# EAGLE design SAMD51_Breakout (EAGLE 9.0.1)
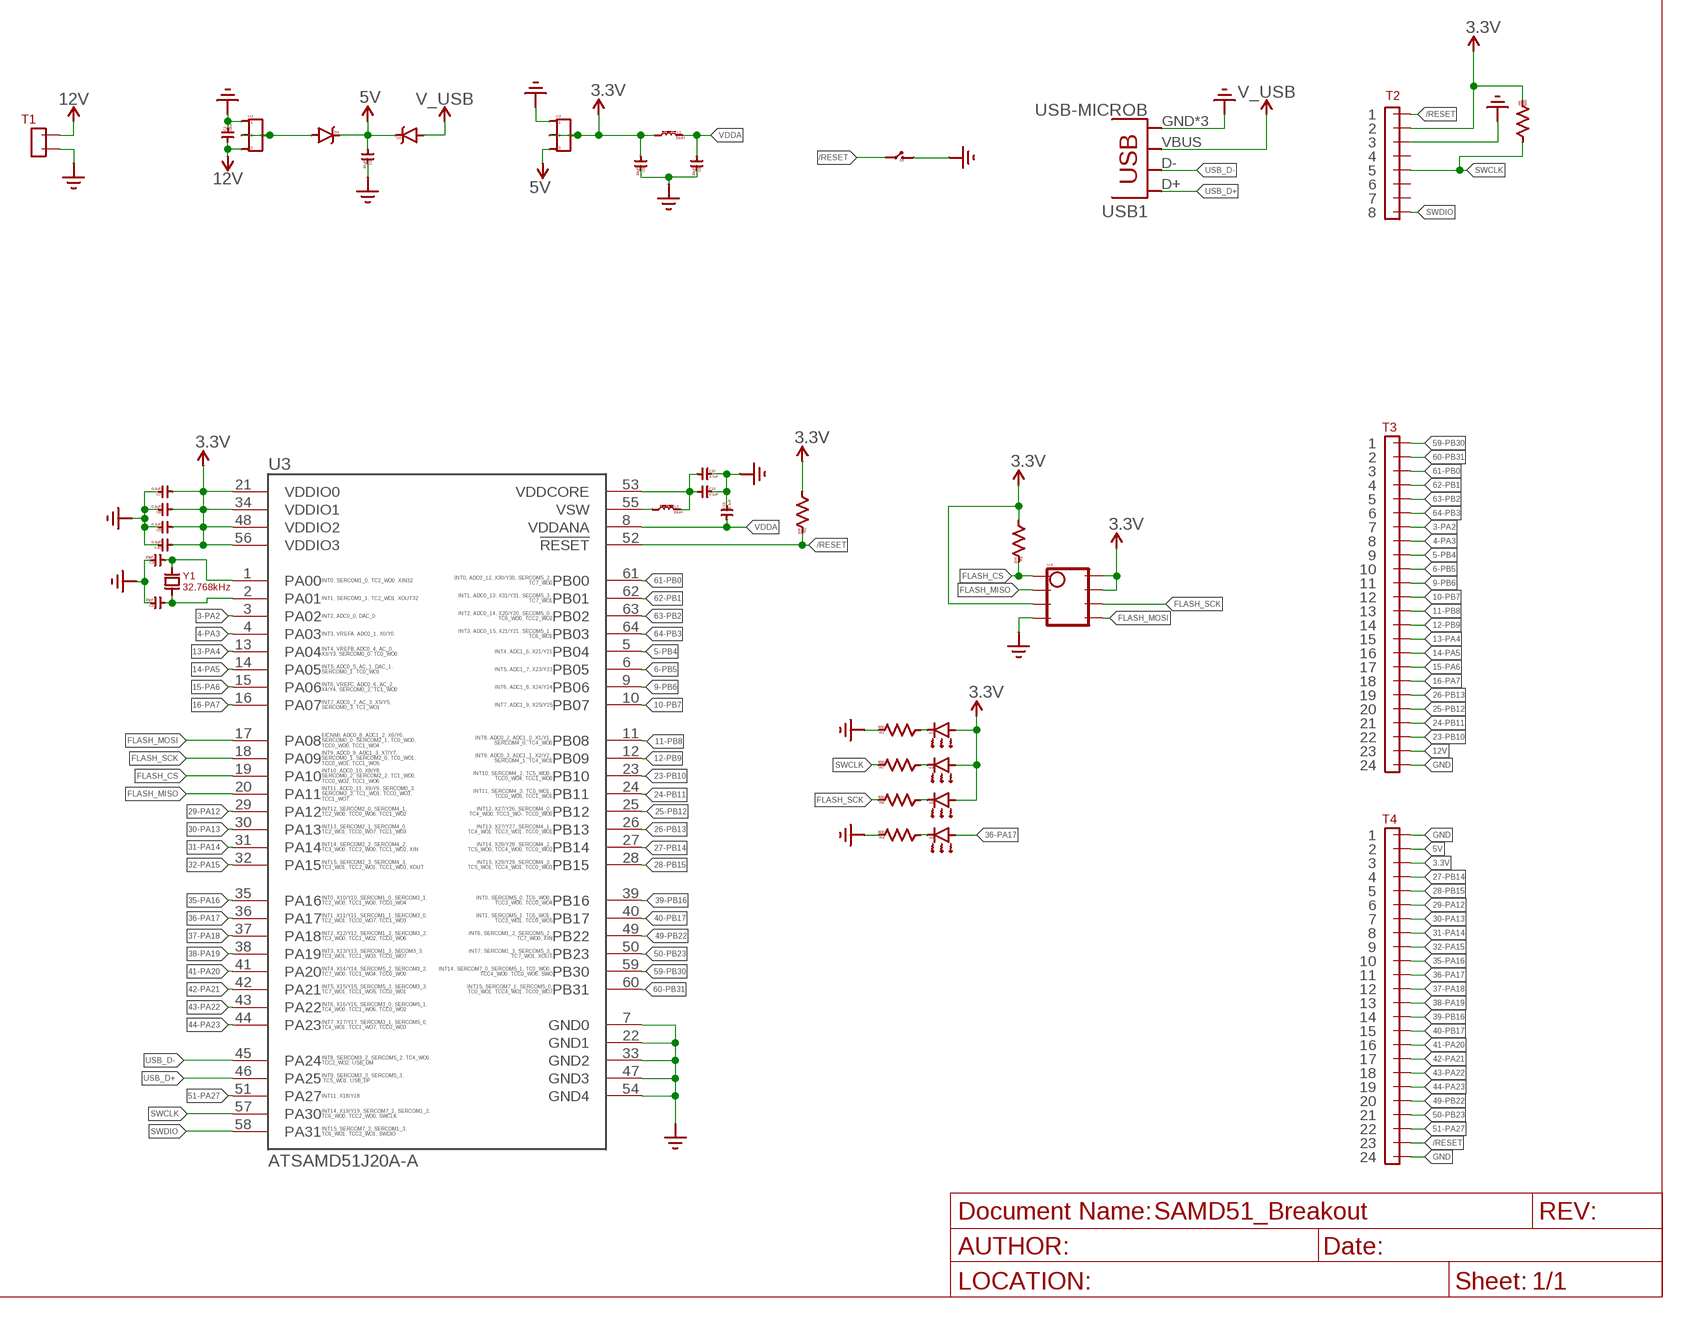
[diagram p0: schematic, sheet 1]

## Parts
C1  22uF  CAP0805  [0805]
C2  47uF  CAP0805  [0805]
C3  15pF  CAP0402  [0402]
C4  15pF  CAP0402  [0402]
C5  10uF  CAP0805  [0805]
C6  10uF  CAP0805  [0805]
C7  0.1uF  CAP0603  [0603]
C8  0.1uF  CAP0603  [0603]
C9  0.1uF  CAP0603  [0603]
C10  0.1uF  CAP0603  [0603]
C11  0.1uF  CAP0603  [0603]
C12  4.7uF  CAP0603  [0603]
C13  0.1uF  CAP0603  [0603]
D1  DIODE_SCHOTTKY1N5819  [1N5819_SMD]
D2  DIODE_SCHOTTKY1N5819  [1N5819_SMD]
L1  10uH  INDUCTOR0805  [0805]
L2  10uH  INDUCTOR0805  [0805]
R1  800  RESISTOR0805  [0805]
R2  10K  RESISTOR0805  [0805]
R3  10K  RESISTOR0805  [0805]
R4  800  RESISTOR0805  [0805]
R5  800  RESISTOR0805  [0805]
R6  800  RESISTOR0805  [0805]
R7  800  RESISTOR0805  [0805]
S1  SWITCHPTS647  [PTS647SK38SMTR2LFS]
T1  PHEONIX_1844210  [PHEONIX_1844210]
T2  CONN_08  [1X08_90DEG]
T3  CONN_24  [1X24]
T4  CONN_24  [1X24]
U1  STANDARD_SOT223  [SOT223]
U2  STANDARD_SOT223  [SOT223]
U3  ATSAMD51J20A-A  [TQFP64]
U4  STANDARD_SOIC-8  [SOIC8]
USB1  USB-MICROB  [USB-MICROB]
V1  LED_SMD0603  [LED_0603]
V2  LED_SMD0603  [LED_0603]
V3  LED_SMD0603  [LED_0603]
V4  LED_SMD0603  [LED_0603]
Y1  32.768kHz  CRYSTAL  [CM7V-T1A]

## Nets
3-PA2: T3.7 U3.3(PA02)
3.3V: C5.1 C7.1 C8.1 C9.1 C10.1 L1.1 R2.1 R3.1 R5.2 T2.2 T4.3 U2.2 U2.4 U3.21(VDDIO0) U3.34(VDDIO1) U3.48(VDDIO2) U3.56(VDDIO3) U4.3 U4.7 U4.8 V1.1 V3.1 V4.1
4-PA3: T3.8 U3.4(PA03)
5-PB4: T3.9 U3.5(PB04)
5V: C2.1 D1.P$2 D2.P$2 T4.2 U2.3
6-PB5: T3.10 U3.6(PB05)
9-PB6: T3.11 U3.9(PB06)
10-PB7: T3.12 U3.10(PB07)
11-PB8: T3.13 U3.11(PB08)
12-PB9: T3.14 U3.12(PB09)
12V: C1.1 T1.1 T3.23 U1.3
13-PA4: T3.15 U3.13(PA04)
14-PA5: T3.16 U3.14(PA05)
15-PA6: T3.17 U3.15(PA06)
16-PA7: T3.18 U3.16(PA07)
23-PB10: T3.22 U3.23(PB10)
24-PB11: T3.21 U3.24(PB11)
25-PB12: T3.20 U3.25(PB12)
26-PB13: T3.19 U3.26(PB13)
27-PB14: T4.4 U3.27(PB14)
28-PB15: T4.5 U3.28(PB15)
29-PA12: T4.6 U3.29(PA12)
30-PA13: T4.7 U3.30(PA13)
31-PA14: T4.8 U3.31(PA14)
32-PA15: T4.9 U3.32(PA15)
35-PA16: T4.10 U3.35(PA16)
36-PA17: T4.11 U3.36(PA17) V2.1
37-PA18: T4.12 U3.37(PA18)
38-PA19: T4.13 U3.38(PA19)
39-PB16: T4.14 U3.39(PB16)
40-PB17: T4.15 U3.40(PB17)
41-PA20: T4.16 U3.41(PA20)
42-PA21: T4.17 U3.42(PA21)
43-PA22: T4.18 U3.43(PA22)
44-PA23: T4.19 U3.44(PA23)
49-PB22: T4.20 U3.49(PB22)
50-PB23: T4.21 U3.50(PB23)
51-PA27: T4.22 U3.51(PA27)
59-PB30: T3.1 U3.59(PB30)
60-PB31: T3.2 U3.60(PB31)
61-PB0: T3.3 U3.61(PB00)
62-PB1: T3.4 U3.62(PB01)
63-PB2: T3.5 U3.63(PB02)
64-PB3: T3.6 U3.64(PB03)
/RESET: R2.2 S1.P$1 S1.P$2 T2.1 T4.23 U3.52(!RESET)
FLASH_CS: R3.2 U3.19(PA10) U4.1
FLASH_MISO: U3.20(PA11) U4.2
FLASH_MOSI: U3.17(PA08) U4.5
FLASH_SCK: R6.2 U3.18(PA09) U4.6
GND: C1.2 C2.2 C3.2 C4.2 C5.2 C6.2 C7.2 C8.2 C9.2 C10.2 C11.2 C12.2 C13.2 R1.2 R4.2 S1.P$3 S1.P$4 T1.2 T2.3 T3.24 T4.1 T4.24 U1.1 U2.1 U3.7(GND0) U3.22(GND1) U3.33(GND2) U3.47(GND3) U3.54(GND4) U4.4 USB1.GND USB1.MT1(GND) USB1.MT2(GND)
N$1: R1.1 V1.2
N$2: R4.1 V2.2
N$3: C4.1 U3.1(PA00) Y1.P$2
N$4: D1.P$1 U1.2 U1.4
N$5: C3.1 U3.2(PA01) Y1.P$1
N$6: R6.1 V3.2
N$7: R7.1 V4.2
SWCLK: R5.1 R7.2 T2.5 U3.57(PA30)
SWDIO: T2.8 U3.58(PA31)
USB_D+: U3.46(PA25) USB1.D+
USB_D-: U3.45(PA24) USB1.D-
V_USB: D2.P$1 USB1.VBUS
VDDA: C6.1 C11.1 L1.2 U3.8(VDDANA)
VDDCORE: C12.1 C13.1 L2.2 U3.53(VDDCORE)
VSW: L2.1 U3.55(VSW)
Unconnected: T2.4 T2.6 T2.7

## Library data of the parts
C1-C13 = Ernest_Components:CAP: General Capacitor
D1 D2 = Ernest_Components:DIODE_SCHOTTKY
L1 L2 = Ernest_Components:INDUCTOR
R1-R7 = Ernest_Components:RESISTOR: General Resistor
S1 = Ernest_Components:SWITCH
T1 = Ernest_Connectors:PHEONIX_1844210: 3- Pin 3.5mm pitch, 90 deg plug-in. Pheonix-1844210 connector. Datasheet: https://media.digikey.com/pdf/Data%20Sheets/Phoenix%20Contact%20PDFs/1844252.pdf <https://media.digikey.com/pdf/Data%20Sheets/Phoenix%20Contact%20PDFs/1844210.pdf>
T2 = Ernest_Connectors:CONN_08: Multi connection point. Often used as Generic Header-pin footprint for 0.1 inch spaced/style header connections
T3 T4 = Ernest_Connectors:CONN_24: Multi connection point. Often used as Generic Header-pin footprint for 0.1 inch spaced/style header connections
U1 U2 = Ernest_IC:STANDARD_SOT223: Voltage Regulator LM1117 Standard adjustable voltage regulator but in SMD form. Spark Fun Electronics SKU : COM-00595
U3 = SparkFun-IC-Microcontroller:ATSAMD51J20A-A; PROD_ID: IC-13952
U4 = Ernest_IC:STANDARD_SOIC-8
USB1 = Ernest_Connectors:USB: USB Connectors USB-B-PTH is fully proven SKU : PRT-00139/CONN-08278 USB-miniB is fully proven SKU : PRT-00587 USB-A-PCB is untested. USB-A-H is throughly reviewed, but untested. Spark Fun Electronics SKU : PRT-00437 USB-B-SMT is throughly reviewed, but untested. Needs silkscreen touching up. USB-A-S has not been used/tested USB-MB-H has not been used/tested USB-MICROB has been used. CONN-09505; PROD_ID: CONN-09505
V1-V4 = Ernest_Components:LED_SMD
Y1 = Ernest_Components:CRYSTAL: Murata Electronics SMD Resonator: CSTNE16M0V530000R0

## Board
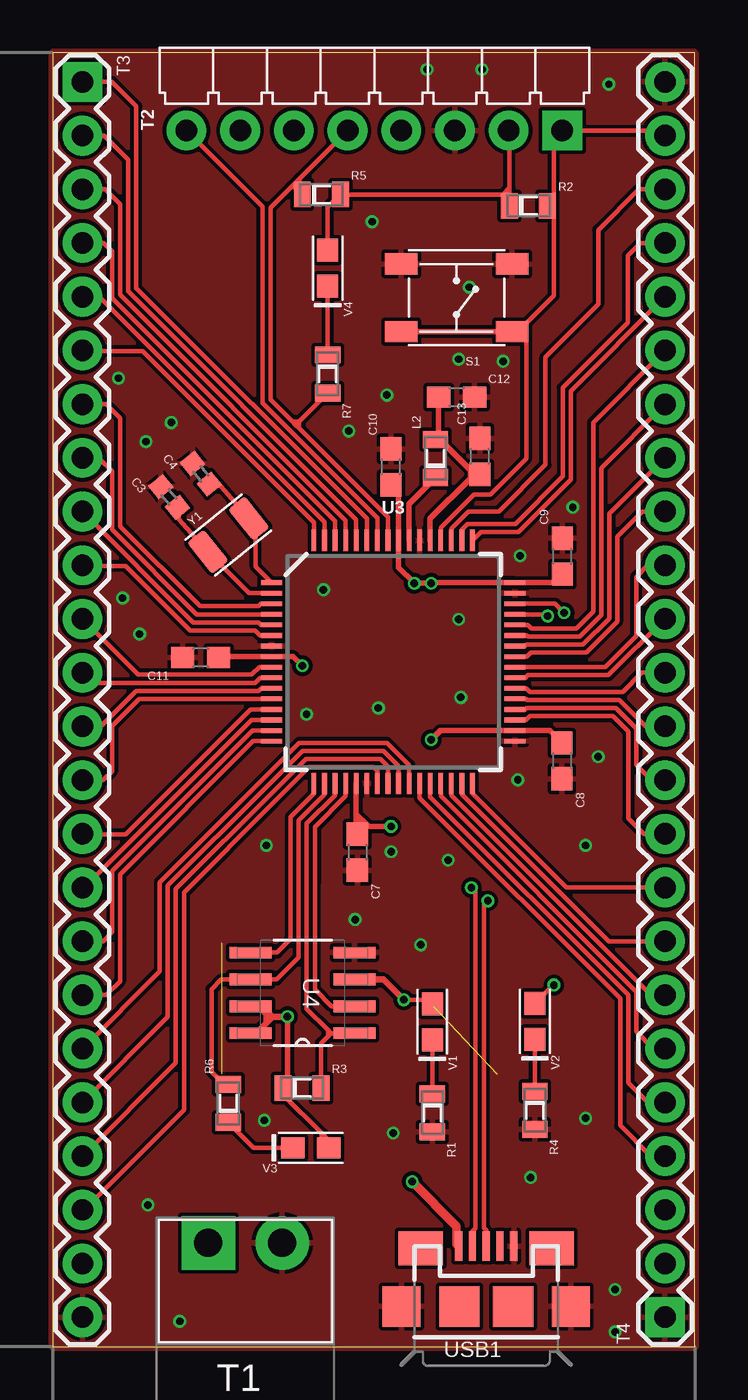
[diagram p1: board, top side]
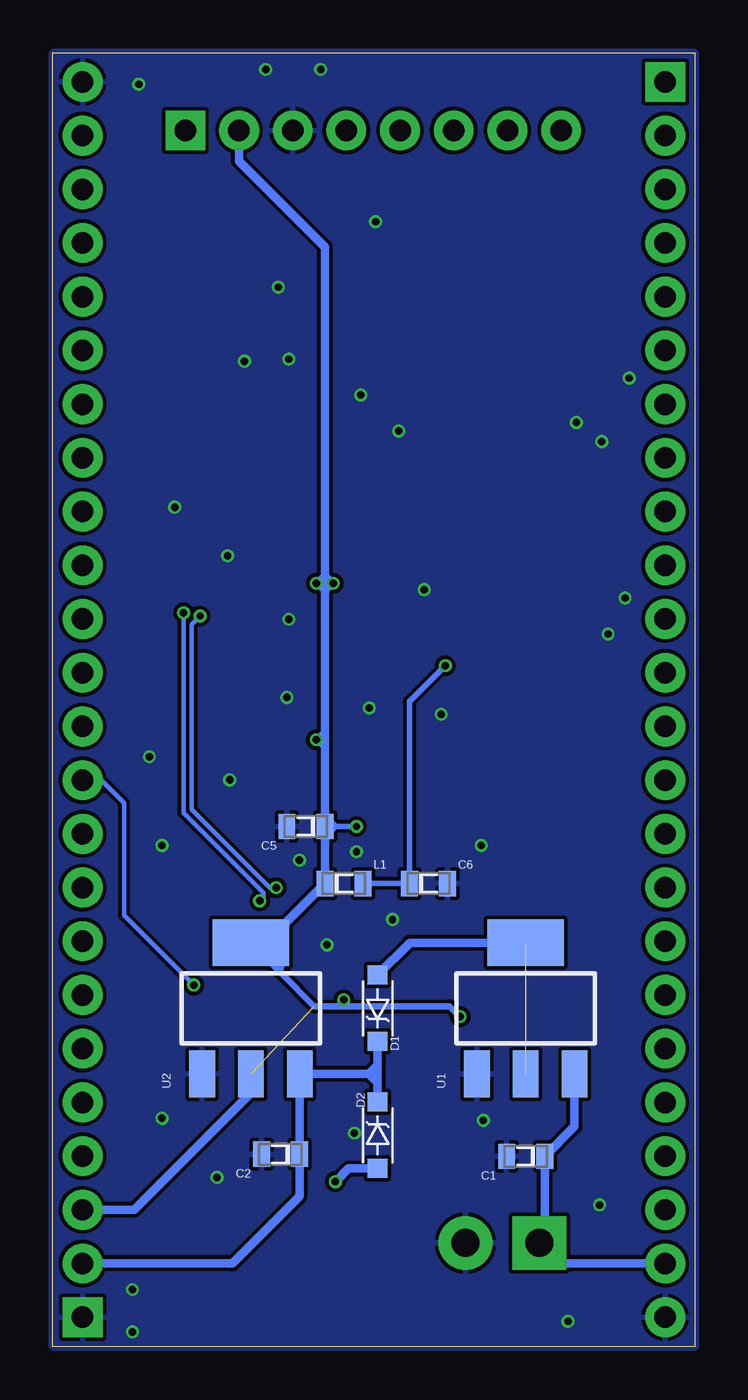
[diagram p2: board, bottom side, seen from below]

Size 30.37 x 61.18 mm. Coordinates in mm from the lower left corner, seen from the top.
Outline: 0,0 30.36,0 30.36,61.18 0,61.18 0,0
Copper layers (1*16): Top 0.035mm / dielectric 1.5mm / Bottom 0.035mm
Design rules "elecrow_zeroDistance": minimum track width 7mil, minimum drill 0.35mm, track to track 7mil, track to pad 7mil, pad to pad 7mil, via to via 7mil, smd to smd 7mil, copper to edge 0mil, drill to drill 7mil, minimum pad ring 7mil, minimum via ring 5mil, stop-mask expansion 4mil, vias tented up to drill 20mil, thermal gap 7mil

### Footprints (pad centres in the part's own frame; a part is rotated, then mirrored left to right if it is on the bottom)
0805 = smd 0.8 x 1.2: 1 -0.9,0; 2 0.9,0
0402 = smd 0.8 x 0.9: 1 -0.63,0; 2 0.63,0
0603 = smd 1.1 x 1: 1 -0.85,0; 2 0.85,0
1N5819_SMD = smd 0.9 x 0.95: P$1 -1.575,0; P$2 1.575,0
PTS647SK38SMTR2LFS = smd 1.55 x 1: P$1 -2.625,1.6; P$2 2.625,1.6; P$3 -2.625,-1.6; P$4 2.625,-1.6
PHEONIX_1844210 = drill 1.321 pad 2.54 square: 1 -1.75,0 | drill 1.321 pad 2.54: 2 1.75,0
1X08_90DEG = drill 1.016 pad 1.88 square: 1 8.89,0 | drill 1.016 pad 1.88: 2 6.35,0; 3 3.81,0; 4 1.27,0; 5 -1.27,0; 6 -3.81,0; 7 -6.35,0; 8 -8.89,0
1X24 = drill 1.016 pad 1.88 square: 1 -29.21,0 | drill 1.016 pad 1.88: 2 -26.67,0; 3 -24.13,0; 4 -21.59,0; 5 -19.05,0; 6 -16.51,0; 7 -13.97,0; 8 -11.43,0; 9 -8.89,0; 10 -6.35,0; 11 -3.81,0; 12 -1.27,0; 13 1.27,0; 14 3.81,0; 15 6.35,0; 16 8.89,0; 17 11.43,0; 18 13.97,0; 19 16.51,0; 20 19.05,0; 21 21.59,0; 22 24.13,0; 23 26.67,0; 24 29.21,0
SOT223 = smd 1.219 x 2.235: 1 -2.311,-3.099; 2 0,-3.099; 3 2.311,-3.099 | smd 3.6 x 2.2: 4 0,3.099
TQFP64 = smd 0.22 x 1: 1 -3.75,-5.75; 2 -3.25,-5.75; 3 -2.75,-5.75; 4 -2.25,-5.75; 5 -1.75,-5.75; 6 -1.25,-5.75; 7 -0.75,-5.75; 8 -0.25,-5.75; 9 0.25,-5.75; 10 0.75,-5.75; 11 1.25,-5.75; 12 1.75,-5.75; 13 2.25,-5.75; 14 2.75,-5.75; 15 3.25,-5.75; 16 3.75,-5.75; 33 3.75,5.75; 34 3.25,5.75; 35 2.75,5.75; 36 2.25,5.75; 37 1.75,5.75; 38 1.25,5.75; 39 0.75,5.75; 40 0.25,5.75; 41 -0.25,5.75; 42 -0.75,5.75; 43 -1.25,5.75; 44 -1.75,5.75; 45 -2.25,5.75; 46 -2.75,5.75; 47 -3.25,5.75; 48 -3.75,5.75 | smd 1 x 0.22: 17 5.75,-3.75; 18 5.75,-3.25; 19 5.75,-2.75; 20 5.75,-2.25; 21 5.75,-1.75; 22 5.75,-1.25; 23 5.75,-0.75; 24 5.75,-0.25; 25 5.75,0.25; 26 5.75,0.75; 27 5.75,1.25; 28 5.75,1.75; 29 5.75,2.25; 30 5.75,2.75; 31 5.75,3.25; 32 5.75,3.75; 49 -5.75,3.75; 50 -5.75,3.25; 51 -5.75,2.75; 52 -5.75,2.25; 53 -5.75,1.75; 54 -5.75,1.25; 55 -5.75,0.75; 56 -5.75,0.25; 57 -5.75,-0.25; 58 -5.75,-0.75; 59 -5.75,-1.25; 60 -5.75,-1.75; 61 -5.75,-2.25; 62 -5.75,-2.75; 63 -5.75,-3.25; 64 -5.75,-3.75
SOIC8 = smd 1.981 x 0.559: 1 -2.464,1.905; 2 -2.464,0.635; 3 -2.464,-0.635; 4 -2.464,-1.905; 5 2.464,-1.905; 6 2.464,-0.635; 7 2.464,0.635; 8 2.464,1.905
USB-MICROB = smd 0.35 x 1.4: D+ 0,2.85; D- -0.65,2.85; GND 1.3,2.85; ID 0.65,2.85; VBUS -1.3,2.85 | smd 1.8 x 1.9: MT1 -4,0; MT2 4,0 | smd 1.9 x 1.9: P$1 -1.27,0; P$2 1.27,0 | smd 2.1 x 1.6: P$3 -3.1,2.75; P$4 3.1,2.75
LED_0603 = smd 1.1 x 1: 1 -0.85,0; 2 0.85,0
CM7V-T1A = smd 1 x 1.9: P$1 -1.25,0; P$2 1.25,0

### Placement (x,y rotation side)
C1  10uF  [0805]  8,9 180 bottom
C2  19.6,9.1 180 bottom
C3  5.5,40.18 129 top
C4  7,41.28 129 top
C5  18.4,24.6 180 bottom
C6  12.6,21.9 0 bottom
C7  14.4,23.38 270 top
C8  24.08,27.7 270 top
C9  24.1,37.38 90 top
C10  16,41.6 90 top
C11  6.99,32.59 180 top
C12  19.1,44.9 0 top
C13  20.2,42.1 90 top
D1  15,16 270 bottom
D2  15,10 90 bottom
L1  16.6,21.9 0 bottom
L2  18.1,42 90 top
R1  17.95,11.06 270 top
R2  22.5,53.95 0 top
R3  11.79,12.23 0 top
R4  22.8,11.18 270 top
R5  12.7,54.48 0 top
R6  8.3,11.5 90 top
R7  13,46 270 top
S1  19.1,49.6 180 top
T1  9.1,4.9 0 top
T2  15.21,57.51 0 top
T3  1.4,30.6 270 top
T4  28.96,30.6 90 top
U1  8,16 0 bottom
U2  21,16 0 bottom
U3  16.1,32.38 270 top
U4  11.81,16.73 180 top
USB1  20.5,1.9 0 top
V1  17.95,15.36 270 top
V2  22.8,15.38 270 top
V3  12.2,9.4 180 top
V4  13,51 270 top
Y1  8.3,38.38 39 top

### Tracks (layer width: path | path; a pad name or v marks a point on that pad's centre or on a via)
3-PA2
  Top 0.203: T3.7 2.53,44.57 3.18,43.92 3.18,38.79 6.96,35.01 9.73,35.01 9.85,35.13 U3.3
3.3V  (via drill 0.35)  (1 unrouted)
  Top 0.203: 21.6,54.3 R2.1 21.6,54.8 | 21.6,54.8 21.6,57.47 | 21.6,54.8 21.28,54.48 R5.2 13,53.88 V4.1 | R3.1 10.89,11.91 12.7,10.1 | 12.7,10.1 13.05,9.75 V3.1 12.7,9.4 12.7,10.1 | v16.6,16.4 17.76,16.4 V1.1
  Top 0.254: C9.1 23.7,36.13 U3.48 17.93,36.13 v17.9,36.1 v17.1,36.1 16.35,36.85 U3.56 16.35,40.4 C10.1 | C8.1 23.5,29.13 U3.34 18.33,29.13 v17.9,28.7 | v11.1,15.6 11.1,12.45 R3.1 | U3.21 14.35,25.2 | 14.35,25.2 14.35,25 | 14.35,25 14.35,24.28 C7.1 | 14.35,25 14.75,24.6 14.95,24.6 | 14.95,24.6 v16,24.6 | 14.95,24.6 14.35,25.2
  Top 0.305: v11.1,15.6 10.4,15.6 | 10.4,15.6 10,16 9.8,16 | 9.8,16 9.44,16 U4.7 | 10.4,15.6 10.1,15.3 | 10.1,15.3 9.62,14.82 U4.8 | 10.1,15.3 10.1,15.7 9.8,16 | v16.6,16.4 15.64,17.36 U4.3
  Top 0.406: 21.6,57.47 T2.2
  Bottom 0.203: U2.4 20.3,19.1 19.45,18.25 19.45,18.05 19.55,17.95 | 19.7,17.8 19.55,17.95 | 19.55,17.95 19.85,17.95 | 19.55,17.95 19.55,17.65
  Bottom 0.254: v16,24.6 17,24.6 | 17,24.6 17.5,25.1 | 17,24.6 17.5,24.1 | 17.5,29 17.6,29 v17.9,28.7 17.5,28.3 | v17.9,36.1 17.5,36.5 v17.1,36.1 17.5,35.7 v17.9,36.1
  Bottom 0.305: 20.4,19.1 U2.4 19.85,17.95 19.7,17.8 19.55,17.65 18,16.1 16.9,16.1 | 16.9,16.1 v16.6,16.4 | 16.9,16.1 11.6,16.1 v11.1,15.6
  Bottom 0.406: U2.4 20.1,20 | T2.2 21.56,56.06 17.5,52 17.5,36.5 17.5,35.7 17.5,29 17.5,28.3 17.5,25.1 C5.1 17.5,24.1 L1.1 20.3,19.1 U2.4 | U2.2 21,12 26.53,6.47 T4.3 | U2.4 21,18.6 | U2.4 20,19.1
4-PA3
  Top 0.203: T3.8 1.4,42 2.2,42 2.8,41.4 2.8,38.63 6.8,34.63 U3.4
5-PB4
  Top 0.203: U3.5 9.85,34.13 9.73,34.25 6.64,34.25 T3.9
5V
  Bottom 0.406: D1.P$2 15,13.3 | 15,13.3 15,13 | 15,13 15,12.5 | 15,12.5 D2.P$2 | 15,13 15.1,12.9 15.4,12.9 | 15.4,12.9 U2.3 C2.1 18.7,7.7 18.7,7.1 20.6,5.2 21.87,3.93 T4.2 | 15.4,12.9 15,13.3 | 15.4,12.9 15,12.5
6-PB5
  Top 0.203: T3.10 1.44,36.91 3.44,36.91 6.48,33.87 9.57,33.87 9.81,33.63 U3.6
9-PB6
  Top 0.203: U3.9 9.77,32.13 9.41,31.77 4.04,31.77 T3.11
10-PB7
  Top 0.203: U3.10 9.81,31.63 9.57,31.39 1.88,31.39 T3.12
11-PB8
  Top 0.203: U3.11 9.85,31.13 9.73,31.01 3.93,31.01 2.21,29.29 1.44,29.29 T3.13
12-PB9
  Top 0.203: U3.12 4.09,30.63 2.8,29.34 2.8,27.2 2.39,26.79 T3.14
12V
  Bottom 0.406: U1.3 5.69,10.41 C1.1 7.1,5.15 T1.1 6.38,3.93 5.8,3.93 T3.23
13-PA4
  Top 0.203: 9.85,30.13 U3.13 9.36,30.13 3.44,24.21 1.44,24.21 T3.15
14-PA5
  Top 0.203: U3.14 9.4,29.63 1.48,21.71 T3.16
15-PA6
  Top 0.203: U3.15 9.44,29.13 2.8,22.49 2.8,19.6 2.37,19.17 T3.17
16-PA7
  Top 0.203: 10,28.63 U3.16 9.48,28.63 3.18,22.33 3.18,17.28 2.53,16.63 T3.18
23-PB10
  Top 0.203: U3.23 15.35,27.23 15.17,27.41 12.12,27.41 11.96,27.25 | 11.96,27.25 11.96,27.24 | 10.4,25.68 11.96,27.25 | 10.4,25.68 | 10.4,25.68 6.2,21.48 6.2,11.19 1.48,6.47 T3.22
24-PB11
  Top 0.203: U3.24 15.85,27.43 15.49,27.79 11.97,27.79 10.44,26.26 | 10.44,26.26 | 10.44,26.26 5.82,21.64 5.82,13.43 T3.21 1.48,9.01
25-PB12
  Top 0.203: U3.25 16.35,27.47 15.65,28.17 11.81,28.17 10.01,26.37 | 10.01,26.37 | 10.01,26.37 5.44,21.8 5.44,15.59 T3.20 1.48,11.55
26-PB13
  Top 0.203: U3.26 16.85,27.51 15.8,28.55 11.65,28.55 5.06,21.96 5.06,17.75 T3.19 1.48,14.09
27-PB14
  Top 0.203: U3.27 17.35,25.96 26.84,16.47 26.84,10.46 28.29,9.01 T4.4
28-PB15
  Top 0.203: U3.28 17.85,26 27.22,16.63 27.22,12.48 28.15,11.55 T4.5
29-PA12
  Top 0.203: U3.29 18.35,26.03 27.6,16.78 27.6,14.9 28.41,14.09 T4.6
30-PA13
  Top 0.203: U3.30 18.85,26.07 28.29,16.63 T4.7
31-PA14
  Top 0.203: U3.31 19.35,26.11 26.29,19.17 T4.8
32-PA15
  Top 0.203: U3.32 19.85,26.15 24.29,21.71 T4.9
35-PA16
  Top 0.203: U3.35 22.37,29.63 22.56,29.82 26.48,29.82 27.22,29.08 27.22,24.98 27.95,24.25 T4.10
36-PA17  (via drill 0.35)
  Top 0.203: U3.36 22.33,30.13 22.4,30.2 26.64,30.2 27.6,29.24 27.6,27.5 28.31,26.79 T4.11 | V2.1 23.67,17.1 v23.7,17.1
  Bottom 0.203: v23.7,17.1 27,20.4 27,25.7 28.09,26.79 T4.11
37-PA18
  Top 0.203: U3.37 22.37,30.63 22.42,30.58 26.8,30.58 28.05,29.33 T4.12
38-PA19
  Top 0.203: U3.38 22.41,31.13 22.58,30.96 26.96,30.96 27.87,31.87 T4.13
39-PB16
  Top 0.203: U3.39 22.36,31.63 22.47,31.75 26.29,31.75 T4.14
40-PB17
  Top 0.203: U3.40 26.13,32.13 27.6,33.6 27.6,36.4 28.15,36.95 T4.15
41-PA20
  Top 0.203: T4.16 27.89,39.49 26.7,38.3 26.7,34.28 25.24,32.82 22.62,32.82 22.43,32.63 U3.41
42-PA21
  Top 0.203: T4.17 26.32,39.39 26.32,34.44 25.08,33.2 22.41,33.2 22.33,33.13 U3.42
43-PA22
  Top 0.203: T4.18 25.94,41.55 25.94,34.6 24.93,33.59 22.48,33.59 22.43,33.63 U3.43
44-PA23
  Top 0.203: T4.19 25.56,43.71 25.56,34.76 24.77,33.97 22.63,33.97 22.47,34.13 U3.44
49-PB22
  Top 0.203: U3.49 20.25,38.53 22.03,38.53 24.5,41 24.5,45.19 T4.20
50-PB23
  Top 0.203: U3.50 19.35,38.65 19.61,38.91 21.87,38.91 24.12,41.16 24.12,45.35 27.2,48.43 27.2,51.6 27.79,52.19 T4.21
51-PA27
  Top 0.203: U3.51 18.85,38.69 19.66,39.5 21.1,39.5 23.3,41.7 23.3,46.8 25.8,49.3 25.8,52.8 27.73,54.73 T4.22
59-PB30
  Top 0.203: U3.59 14.85,39.15 3.94,50.06 3.94,58.66 2.79,59.81 T3.1
60-PB31
  Top 0.203: U3.60 14.35,39.11 3.56,49.9 3.56,56.14 2.43,57.27 T3.2
61-PB0
  Top 0.203: U3.61 13.85,39.08 3.18,49.74 3.18,54.02 2.47,54.73 T3.3
62-PB1
  Top 0.203: U3.62 13.35,39.04 2.8,49.59 2.8,51.8 2.41,52.19 T3.4
63-PB2
  Top 0.203: U3.63 12.85,39 2.2,49.65 T3.5
64-PB3
  Top 0.203: U3.64 12.35,38.96 4.24,47.07 1.44,47.07 T3.6
/RESET
  Top 0.203: 22,48 22.4,47.6 22.4,42 20.7,40.3 19.92,40.3 18.35,38.73 U3.52 | S1.P$1 22,48 | 22,48 23.7,49.7 23.7,53.65 R2.2 23.7,54.25 23.7,57.11 T2.1 28.72,57.51 T4.23
  Top 0.254: S1.P$1 S1.P$2
FLASH_CS
  Top 0.203: U4.1 13.16,14.82 | 13.16,14.82 13.01,14.97 | 13.16,14.82 13.01,14.67 | 13.01,14.67 12.69,14.35 R3.2 | 13.01,14.67 13.01,14.97 | 13.01,14.97 12.01,15.97 12.01,24.73 13.35,26.07 U3.19
FLASH_MISO
  Top 0.203: U4.2 13.19,16.09 12.39,16.89 12.39,21.89 12.4,21.9 12.39,21.91 12.39,24.58 13.85,26.03 U3.20
FLASH_MOSI
  Top 0.203: U4.5 10.61,18.63 11.25,19.27 11.25,25.05 12.35,26.15 U3.17
FLASH_SCK
  Top 0.203: U3.18 12.85,26.11 11.63,24.89 11.63,18.41 10.58,17.36 U4.6 7.96,17.36 7.5,16.9 7.5,13 7.8,12.7 8.1,12.4 R6.2
GND  (via drill 0.35)
  other vias: 17.7,60.4 20.3,60.4 26.3,59.7 15.1,53.2 19.7,50.1 21.3,46.6 19.2,46.7 3.1,45.8 4.4,42.8 5.6,43.7 14,43.3 15.8,45 24.6,39.7 22.1,37.4 12.8,35.8 19.2,34.4 19.3,30.7 15.4,30.2 12,29.9 3.3,35.4 4.1,33.7 22,26.8 25.8,27.9 25.2,23.7 10.1,23.7 16,23.4 18.7,23 14.3,20.2 17.4,19 25.2,10.8 22.6,8 16.1,10.1 10,10.7 26.6,2.7 26.6,0.7 4.5,6.7 6,1.2
  pour Top: -0.1,0 -0.1,61.17 0,61.27 30.36,61.27 30.46,61.17 30.46,0 30.36,-0.1 0,-0.1
  pour Bottom: -0.1,0 -0.1,61.17 0,61.27 30.36,61.27 30.46,61.17 30.46,0 30.36,-0.1 0,-0.1
N$1
  Top 0.203: V1.2 R1.1
N$2
  Top 0.203: R4.1 V2.2
N$3
  Top 0.203: U3.1 9.6,36.88 9.6,38.84 Y1.P$2 7.79,40.87 C4.1 7.93,40.7
N$4  (1 unrouted)
  Bottom 0.406: U1.4 13.48,19.1 D1.P$1
N$5
  Top 0.203: U3.2 9.29,35.63 Y1.P$1 5.96,39.14 | 5.96,39.14 5.86,39.25 C3.1 5.96,39.14
N$6
  Top 0.203: R6.1 9.5,9.4 V3.2
N$7
  Top 0.203: V4.2 R7.1
SWCLK
  Top 0.203: U3.57 15.85,39.23 11.64,43.44 | 11.34,43.74 10.3,44.78 10.3,53.87 11.27,54.84 | 11.34,43.74 11.49,43.59 | 11.49,43.59 11.64,43.44 | 11.27,54.84 11.66,55.23 | 11.66,55.23 T2.5 | 11.27,54.84 11.45,54.84 R5.1 11.66,54.62 11.66,55.23 | R7.2 11.7,43.8 11.64,43.74 | 11.64,43.74 11.49,43.59 | 11.64,43.74 11.64,43.44 | 11.64,43.74 11.34,43.74
SWDIO
  Top 0.203: U3.58 15.35,39.19 9.92,44.62 9.92,53.91 T2.8
USB_D+  (via drill 0.35)
  Top 0.203: U3.46 23.75,35.13 v24.18,34.7 | USB1.D+ 20.5,5.5 20.38,5.62 20.38,21.08 v20.58,21.08
  Bottom 0.203: v20.58,21.08 20.4,21.26 20.4,21.46 24.18,25.24 v24.18,34.7
USB_D-  (via drill 0.35)
  Top 0.203: U3.45 23.32,34.63 v23.4,34.55 | USB1.D- 19.85,5.45 20,5.6 20,21.5 v19.8,21.7
  Bottom 0.203: v23.4,34.55 23.8,34.15 23.8,25.4 20.1,21.7 v19.8,21.7
V_USB  (via drill 0.35)
  Top 0.305: 19.1,4.85 USB1.VBUS
  Top 0.406: 19.1,4.85 19.1,5.7 v17,7.8
  Bottom 0.406: v17,7.8 16.38,8.43 D2.P$1
VDDA  (via drill 0.35)
  Top 0.254: v11.8,32.2 11.37,32.63 U3.8 7.88,32.63 C11.1
  Bottom 0.254: v11.8,32.2 13.5,30.5 C6.1 L1.2
VDDCORE
  Top 0.254: 20.05,41.15 C13.1 | U3.53 17.85,39.15 19.75,41.05 | 19.9,40.85 C13.1 | 19.75,41.05 19.95,41.25 | C12.1 18.25,43.05 L2.2 18.3,42.9 19.7,41.5 19.75,41.45 | 19.95,41.25 C13.1 | 19.75,41.45 19.95,41.25 | 19.75,41.45 19.75,41.05
VSW
  Top 0.254: U3.55 16.85,39 16.85,39.85 L2.1

### Text on the board
tSilk: 59 | GND | 60 | RST | SWDIO | SWCLK | GND | 3.3V | RST | 61 | 51 | R5 | R2 | RESET | 62 | 50 | 63 | SWCLK | 49 | V4 | 64 | 44 | R7 | 3 | C12 | 43 | L2 | C3 | 4 | C4 | C10 | C13 | 42 | Y1 | 5 | C9 | 41 | 6 | 40 | 9 | C11 | 39 | 10 | 38 | C8 | 11 | 37 | 12 | 36 | 13 | 35 | C7 | 14 | 32 | 15 | 31 | V1 | V2 | 16 | 30 | 36-PA17 | PWR | 26 | U4 | 29 | 25 | R3 | 28 | FLASH | 24 | R6 | V3 | R1 | R4 | 27 | Vin | GND | 23 | 3.3V | Vin | 5V | GND | GND